# Altium project FlowCandle.PrjPcb
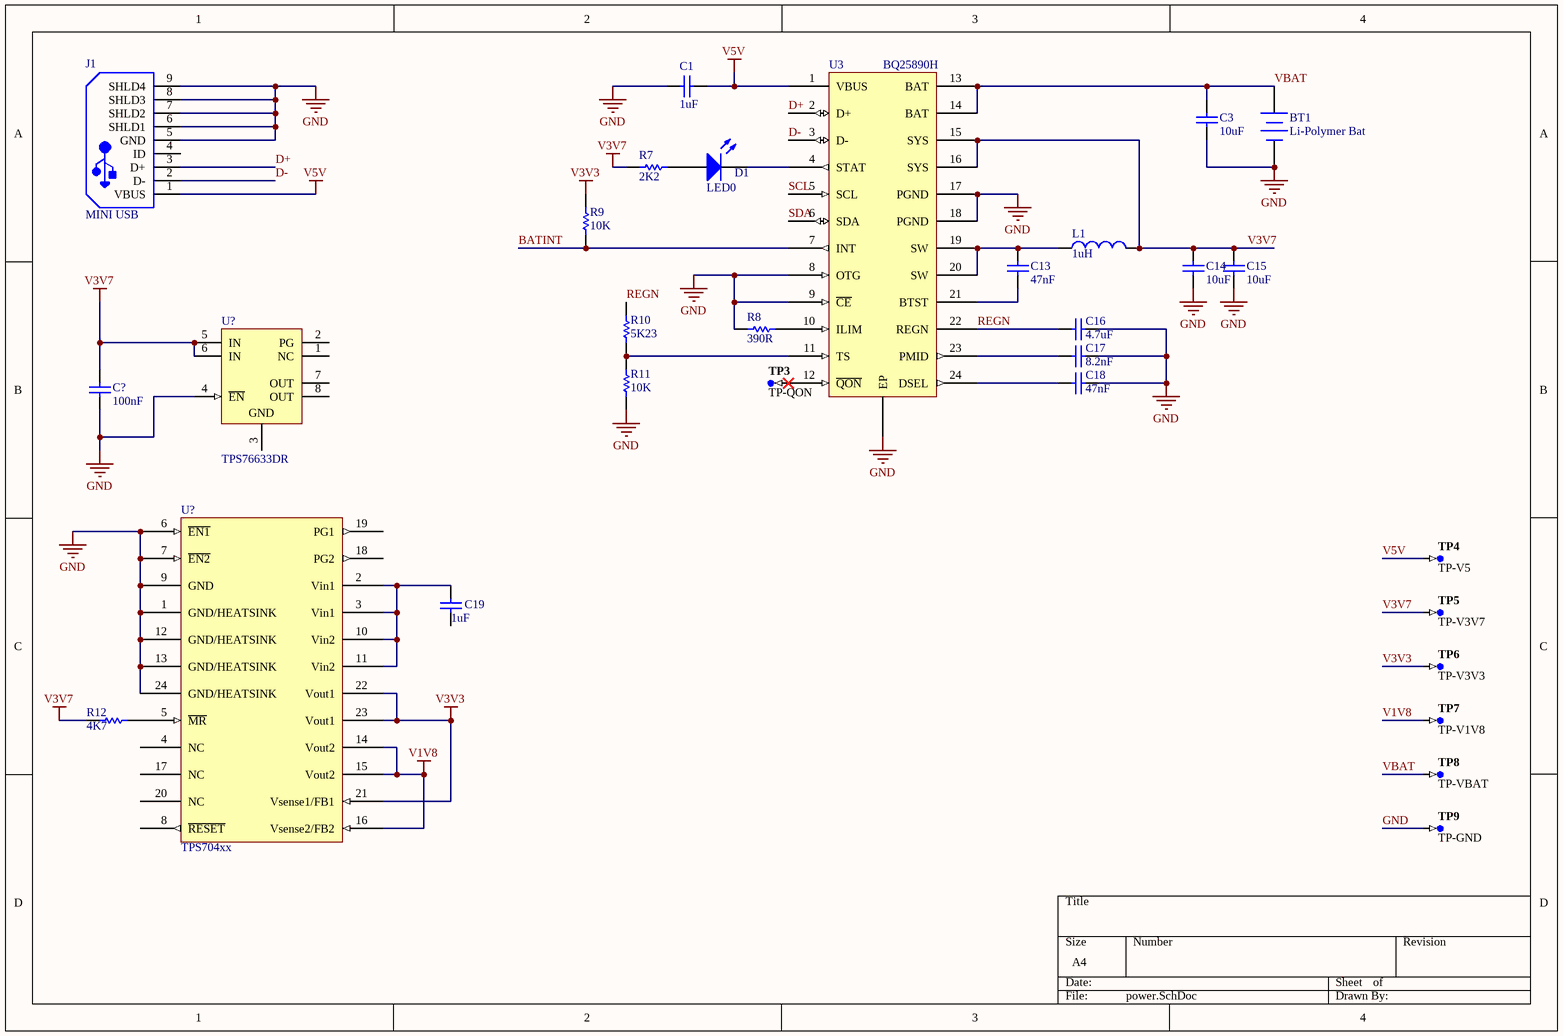
[diagram p0: power.SchDoc]
2 sheets, 54 parts. Net scope: global (net labels, ports and power ports of the same name join across sheets).
Board file: candlebtm.PcbDoc
Sheets:
  power.SchDoc
  board.SchDoc

## Sheet power.SchDoc
size A4; PageSetup: Record=PageOptions|CenterHorizontal=True|CenterVertical=True|PrintScale=0.97|XCorrection=1.00|YCorrection=1.00|PrintKind=1|BorderSize=5000000|LeftOffset=0|BottomOffset=0|Orientation=2|PaperLength=2970|PaperWidth=2100|Scale=100|PaperSource=1|PrintQuality=-3|MediaType=1|DitherType=10|PrintScaleMode=1|PaperKind=A4|PaperIndex=9

### Parts
(Parts that share a designator on the sheet are numbered #1, #2 ... from top to bottom, then left to right.)
BT1  Li-Polymer Bat  [BAT-2]
C1  1uF  [CAPC0603(1608)100_M]
C3  10uF  [CAPC0603(1608)100_M]
C13  47nF  [CAPC0603(1608)100_M]
C14  10uF  [CAPC0603(1608)100_M]
C15  10uF  [CAPC0603(1608)100_M]
C16  4.7uF  [CAPC0603(1608)100_M]
C17  8.2nF  [CAPC0603(1608)100_M]
C18  47nF  [CAPC0603(1608)100_M]
C19  1uF  [CAPC0603(1608)100_M]
C?  100nF  [CAPC0603(1608)100_M]
D1  LED0  [HDR1X2]
J1  MINI USB  [KYCN-KMBX-SMT-5S-S-30TR_V]
L1  value 1uH  [INDC3216]  (hidden comment: Inductor)
R7  2K2  [RESC0603(1608)_M]
R8  390R  [RESC0603(1608)_M]
R9  10K  [RESC0603(1608)_M]
R10  5K23  [RESC0603(1608)_M]
R11  10K  [RESC0603(1608)_M]
R12  4K7  [RESC0603(1608)_M]
TP3  TP-QON  [TP-SM-C-100]  (no BOM)
TP4  TP-V5  [TP-SM-C-100]  (no BOM)
TP5  TP-V3V7  [TP-SM-C-100]  (no BOM)
TP6  TP-V3V3  [TP-SM-C-100]  (no BOM)
TP7  TP-V1V8  [TP-SM-C-100]  (no BOM)
TP8  TP-VBAT  [TP-SM-C-100]  (no BOM)
TP9  TP-GND  [TP-SM-C-100]  (no BOM)
U3  BQ25890H  [RGE24-2700X2700TP]
U?#1  TPS76633DR  [D0008A_N]
U?#2  TPS704xx  [PWP0024A_M]

### Nets
GND: BT1.2(-) C1.1 C3.1 C14.1 C15.1 C16.2 C17.2 C18.2 C?.1 J1.5(GND) J1.6(SHLD1) J1.7(SHLD2) J1.8(SHLD3) J1.9(SHLD4) R8.1 R11.1 TP9.1 U3.8(OTG) U3.9(~{CE}) U3.17(PGND) U3.18(PGND) U3.25(EP) U?#1.4(~{EN}) U?#2.1(GND/HEATSINK) U?#2.6(~{EN1}) U?#2.7(~{EN2}) U?#2.9(GND) U?#2.12(GND/HEATSINK) U?#2.13(GND/HEATSINK) U?#2.24(GND/HEATSINK)
V1V8: TP7.1 U?#2.14(Vout2) U?#2.15(Vout2) U?#2.16(Vsense2/FB2)
V3V3: R9.2 TP6.1 U?#2.21(Vsense1/FB1) U?#2.22(Vout1) U?#2.23(Vout1)
V3V7: C14.2 C15.2 C?.2 L1.2 R7.1 R12.1 TP5.1 U3.15(SYS) U3.16(SYS) U?#1.5(IN) U?#1.6(IN)
V5V: C1.2 J1.1(VBUS) TP4.1 U3.1(VBUS)
BATINT: R9.1 U3.7(INT)
D+: J1.3(D+) U3.2(D+)
D-: J1.2(D-) U3.3(D-)
REGN: C16.1 R10.2 U3.22(REGN)
SCL: U3.5(SCL)
SDA: U3.6(SDA)
VBAT: BT1.1(+) C3.2 TP8.1 U3.13(BAT) U3.14(BAT)
NetC13_1: C13.1 U3.21(BTST)
NetC13_2: C13.2 L1.1 U3.19(SW) U3.20(SW)
NetC17_1: C17.1 U3.23(PMID)
NetC18_1: C18.1 U3.24(DSEL)
NetC19_2: C19.2 U?#2.2(Vin1) U?#2.3(Vin1) U?#2.10(Vin2) U?#2.11(Vin2)
NetD1_1: D1.1(A) R7.2
NetD1_2: D1.2(K) U3.4(STAT)
NetR8_2: R8.2 U3.10(ILIM)
NetR10_1: R10.1 R11.2 U3.11(TS)
NetR12_2: R12.2 U?#2.5(~{MR})
NetTP3_1: TP3.1 U3.12(~{QON})

Not connected (* = marked no-connect by the designer): C19 1; J1 4(ID); U?#1 1(NC) 2(PG) 3(GND) 7(OUT) 8(OUT); U?#2 4(NC) 8(~{RESET}) 17(NC) 18(PG2) 19(PG1) 20(NC)

### Library data of the parts
BT1 = Battery: Multicell Battery; Published: 24-Mar-1999; LatestRevisionDate: 17-Jul-2002; LatestRevisionNote: Re-released for DXP Platform.; PackageReference: BAT-2; Publisher: Altium Limited; PackageDescription: Battery; 2 Leads
C1 C19 = CMP-1034-02119-1: CAP 1uF 16V ±10% 0402 (1005 Metric) Thickness 0.6mm SMD; Case-EIA: 0402; Tolerance: Â±10%; Case-Metric: 1005; Technology: SMT; Rated Voltage: 16 V; Max Thickness: 0.6 mm; Value: 1uF
C3 C14 C15 = CMP-1036-04927-1: CAP 10uF 16V ±10% 0805 (2012 Metric) Thickness 1.45mm SMD; Case-EIA: 0805; Tolerance: Â±10%; Case-Metric: 2012; Rated Voltage: 16 V; Technology: SMT; Value: 10uF; Max Thickness: 1.45 mm
C13 C18 = CMP-1035-02503-1: CAP 47nF 16V ±10% 0603 (1608 Metric) Thickness 1mm SMD; Tolerance: Â±10%; Case-EIA: 0603; Case-Metric: 1608; Technology: SMT; Rated Voltage: 16 V; Max Thickness: 1 mm; Value: 47nF
C16 = CMP-1034-02133-1: CAP 4.7uF 4V ±10% 0402 (1005 Metric) Thickness 0.6mm SMD; Tolerance: Â±10%; Case-Metric: 1005; Case-EIA: 0402; Value: 4.7uF; Rated Voltage: 4 V; Technology: SMT; Max Thickness: 0.6 mm
C17 = CMP-1035-02285-1: CAP 8.2nF 16V ±10% 0603 (1608 Metric) Thickness 1mm SMD; Case-Metric: 1608; Case-EIA: 0603; Tolerance: Â±10%; Value: 8.2nF; Max Thickness: 1 mm; Rated Voltage: 16 V; Technology: SMT
C? = CMP-1034-02064-1: CAP 100nF 10V ±5% 0402 (1005 Metric) Thickness 0.6mm SMD; Tolerance: Â±5%; Case-EIA: 0402; Case-Metric: 1005; Max Thickness: 0.6 mm; Value: 100nF; Rated Voltage: 10 V; Technology: SMT
D1 = LED0: Typical INFRARED GaAs LED; Published: 8-Jun-2000; LatestRevisionDate: 08-Jul-2005; LatestRevisionNote: Mech Layer 1 removed.; PackageReference: LED-0; Publisher: Altium Limited; PackageDescription: LED; 2 Leads
J1 = CMP-1673-00002-6: Female Mini-USB, RA, -55 to 85 degC, 5-Pin SMD, RoHS, Tape and Reel; Manufacturer: Kycon; Current Rating: 1 A; Contact Material: Bronze; Packaging: Tape and Reel; ComponentLink1Description: Manufacturer URL; Mount: Surface Mount; ComponentLink2URL: https://datasheet.ciiva.com/4599/kmbx-smt-5s-s-30tr-180268-4599029.pdf; Colour: Black; Length: 9.9 mm; RoHSCompliant: true; Pins: 5; Mounting Technology: Surface Mount; Height: 3.9 mm; Connector Type: USB; PackageDescription: 5-Pin Surface Mount Device, Body 9.9 x 9.2 mm, Pitch 0.8 mm; ComponentLink1URL: http://www.kycon.com/; PackageReference: KMBX-SMT-5S-S-30TR; ComponentLink2Description: Datasheet; DatasheetVersion: Rev. A7, 11/2013; Contact Plating: Gold; Lead Pitch: 0.8 mm
L1 = Inductor: Code_IEC: 1005; Published: 8-Jun-2000; LatestRevisionDate: 29-May-2009; LatestRevisionNote: IPC-7351 Footprint Added.; PackageReference: 0402-A; Publisher: Altium Limited; PackageDescription: Chip Inductor; Code_JEITA: 0402
R7 = CMP-1012-00082-1: 2K2 0.1W 5% 0603 (1608 Metric)  SMD; Case-Metric: 1608; Value: 2200.00 Ohm; Case-EIA: 0603; Power: 0.1 W; Tolerance: 5 %; Technology: SMT
R8 = CMP-1012-00064-1: 390R 0.1W 5% 0603 (1608 Metric)  SMD; Case-EIA: 0603; Value: 390.00 Ohm; Case-Metric: 1608; Technology: SMT; Power: 0.1 W; Tolerance: 5 %
R9 R11 = CMP-1011-00098-1: Tolerance: 5 %; Value: 10000.00 Ohm; Case-EIA: 0402; Case-Metric: 1005; Power: 0.063 W; Technology: SMT
R10 = CMP-1012-00592-1: 5K23 0.1W 1% 0603 (1608 Metric)  SMD; Case-Metric: 1608; Value: 5230.00 Ohm; Case-EIA: 0603; Tolerance: 1 %; Technology: SMT; Power: 0.1 W
R12 = CMP-1011-00090-1: 4K7 0.063W 5% 0402 (1005 Metric)  SMD; Value: 4700.00 Ohm; Case-EIA: 0402; Case-Metric: 1005; Tolerance: 5 %; Power: 0.063 W; Technology: SMT
TP3-TP9 = CMP-0484-00002-2: Test Point, Surface Mount, Circular, Pad Diameter 1 mm; Manufacturer: No Vendor; PartNumber: TP-SM-C-100
U3 = BQ25890H: I2C Controlled 5A Single Cell with NVDC Power Path Management
U?#1 = CMP-0394-00013-2: Single Output LDO, 250 mA, Fixed 3.3 V Output, 2.7 to 10 V Input, with Low IQ, 8-pin SOIC (D), -40 to 125 degC, Green (RoHS & no Sb/Br); Manufacturer: Texas Instruments; Power Good: TRUE; Vdo(Typ)(mV): 230; Fixed Output Options(V): 3.3; Iout(Max)(A): 0.25; Iq(Typ)(mA): 0.03; Vin(Max)(V): 10; SubFamily: Single Channel LDO; Vin(Min)(V): 2.7; Code_JEDEC: MS-012; ComponentLink1Description: Manufacturer URL; ComponentLink2URL: http://www.ti.com/general/docs/lit/getliterature.tsp?genericPartNumber=TPS76633&fileType=pdf; Mounting Technology: Surface Mount; ComponentLink1URL: http://www.ti.com/; PackageVersion: 4040047-3/M; ComponentLink3Description: Package Specification; DatasheetVersion: SLVS237C; Vout Adj(Max)(V): 3.3; ComponentLink2Description: Datasheet; PackageReference: D0008A; ComponentLink3URL: http://www.ti.com/litv/pdf/msoi002j; Vout Adj(Min)(V): 3.3; PartNumber: TPS76633DR; Eco-Plan: Green (RoHS & no Sb/Br); PackageDescription: 8-Pin Plastic Small Outline, Body 4.9 x 3.9 mm, Pitch 1.27 mm
U?#2 = TPS704: DUAL-OUTPUT, LOW DROPOUT VOLTAGE REGULATORS WITH INTEGRATED SVS FOR SPLIT VOLTAGE SYSTEMS

## Sheet board.SchDoc
size A4
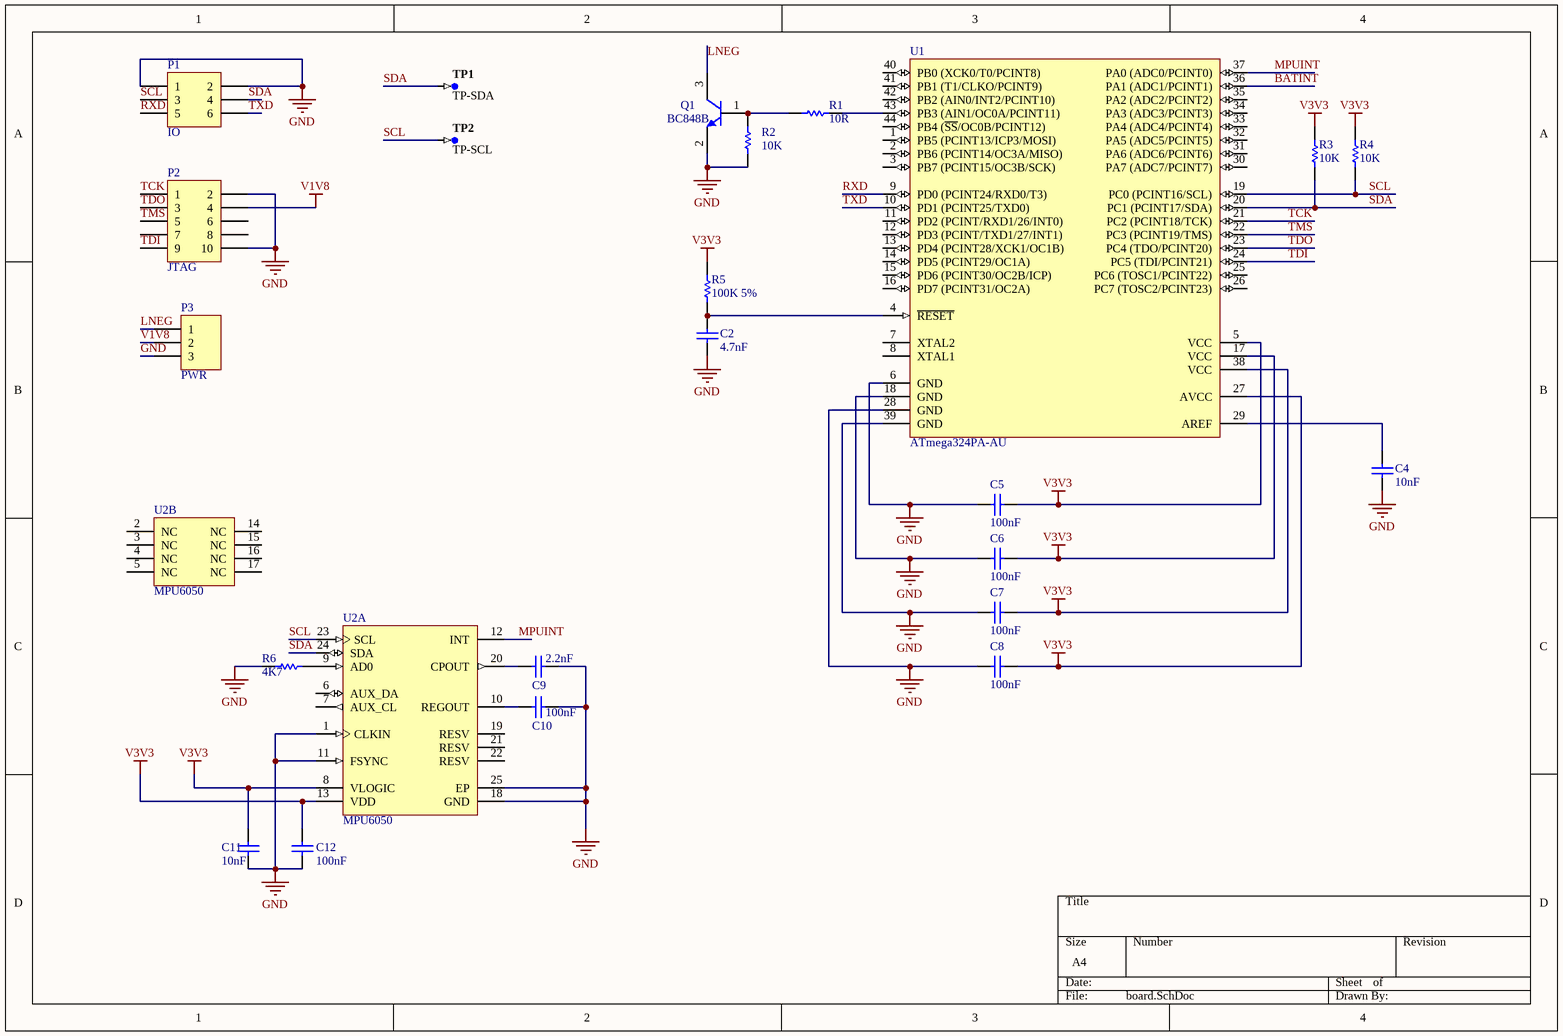
[diagram p1: board.SchDoc]

### Parts
C2  4.7nF  [CAPC0603(1608)100_M]
C4  10nF  [CAPC0603(1608)100_M]
C5  100nF  [CAPC0603(1608)100_M]
C6  100nF  [CAPC0603(1608)100_M]
C7  100nF  [CAPC0603(1608)100_M]
C8  100nF  [CAPC0603(1608)100_M]
C9  2.2nF  [CAPC0603(1608)100_M]
C10  100nF  [CAPC0603(1608)100_M]
C11  10nF  [CAPC0603(1608)100_M]
C12  100nF  [CAPC0603(1608)100_M]
P1  IO  [HDR2X3]
P2  JTAG  [HDR2X5]
P3  PWR  [HDR1X3]
Q1  BC848B  [INF-SOT23_N]
R1  10R  [RESC0603(1608)_M]
R2  10K  [RESC0603(1608)_M]
R3  10K  [RESC0603(1608)_M]
R4  10K  [RESC0603(1608)_M]
R5  100K 5%  [RESC0603(1608)_M]
R6  4K7  [RESC0603(1608)_M]
TP1  TP-SDA  [TP-SM-C-100]  (no BOM)
TP2  TP-SCL  [TP-SM-C-100]  (no BOM)
U1  ATmega324PA-AU  [44A_M]
U2  MPU6050  [INSE-QFN-24_V]  (parts A,B of 2)

### Nets
GND: C2.1 C4.1 C5.1 C6.1 C7.1 C8.1 C9.2 C10.2 C11.1 C12.1 P1.1 P1.2 P2.2 P2.10 P3.3 Q1.2(E) R2.1 R6.1 U1.6(GND) U1.18(GND) U1.28(GND) U1.39(GND) U2.1(CLKIN) U2.11(FSYNC) U2.18(GND) U2.25(EP)
V1V8: P2.4 P3.2
V3V3: C5.2 C6.2 C7.2 C8.2 C11.2 C12.2 R3.2 R4.2 R5.2 U1.5(VCC) U1.17(VCC) U1.27(AVCC) U1.38(VCC) U2.8(VLOGIC) U2.13(VDD)
BATINT: U1.36(PA1_(ADC1/PCINT1))
LNEG: P3.1 Q1.3(C)
MPUINT: U1.37(PA0_(ADC0/PCINT0)) U2.12(INT)
RXD: P1.5 U1.9(PD0_(PCINT24/RXD0/T3))
SCL: P1.3 R4.1 TP2.1 U1.19(PC0_(PCINT16/SCL)) U2.23(SCL)
SDA: P1.4 R3.1 TP1.1 U1.20(PC1_(PCINT17/SDA)) U2.24(SDA)
TCK: P2.1 U1.21(PC2_(PCINT18/TCK))
TDI: P2.9 U1.24(PC5_(TDI/PCINT21))
TDO: P2.3 U1.23(PC4_(TDO/PCINT20))
TMS: P2.5 U1.22(PC3_(PCINT19/TMS))
TXD: P1.6 U1.10(PD1_(PCINT25/TXD0))
NetC2_2: C2.2 R5.1 U1.4(~{RESET})
NetC4_2: C4.2 U1.29(AREF)
NetC9_1: C9.1 U2.20(CPOUT)
NetC10_1: C10.1 U2.10(REGOUT)
NetQ1_1: Q1.1(B) R1.1 R2.2
NetR1_2: R1.2 U1.43(PB3_(AIN1/OC0A/PCINT11))
NetR6_2: R6.2 U2.9(AD0)

Not connected (* = marked no-connect by the designer): P2 6 7 8; U1 1(PB5_(PCINT13/ICP3/MOSI)) 2(PB6_(PCINT14/OC3A/MISO)) 3(PB7_(PCINT15/OC3B/SCK)) 7(XTAL2) 8(XTAL1) 11(PD2_(PCINT/RXD1/26/INT0)) 12(PD3_(PCINT/TXD1/27/INT1)) 13(PD4_(PCINT28/XCK1/OC1B)) 14(PD5_(PCINT29/OC1A)) 15(PD6_(PCINT30/OC2B/ICP)) 16(PD7_(PCINT31/OC2A)) 25(PC6_(TOSC1/PCINT22)) 26(PC7_(TOSC2/PCINT23)) 30(PA7_(ADC7/PCINT7)) 31(PA6_(ADC6/PCINT6)) 32(PA5_(ADC5/PCINT5)) 33(PA4_(ADC4/PCINT4)) 34(PA3_(ADC3/PCINT3)) 35(PA2_(ADC2/PCINT2)) 40(PB0_(XCK0/T0/PCINT8)) 41(PB1_(T1/CLKO/PCINT9)) 42(PB2_(AIN0/INT2/PCINT10)) 44(PB4_(~{SS}/OC0B/PCINT12)); U2 2(NC) 3(NC) 4(NC) 5(NC) 6(AUX_DA) 7(AUX_CL) 14(NC) 15(NC) 16(NC) 17(NC) 19(RESV) 21(RESV) 22(RESV)

### Notes on the sheet
- Title
- Size:
- Date:
- A4
- Number:
- Time:
- Revision:
- Sheet
- of
- File:

### Library data of the parts
C2 = CMP-1034-01811-1: CAP 4.7nF 16V ±20% 0402 (1005 Metric) Thickness 0.6mm SMD; Case-EIA: 0402; Tolerance: Â±20%; Case-Metric: 1005; Technology: SMT; Value: 4.7nF; Max Thickness: 0.6 mm; Rated Voltage: 16 V
C4 = CMP-1034-01883-1: CAP 10nF 35V ±10% 0402 (1005 Metric) Thickness 0.6mm SMD; Tolerance: Â±10%; Case-Metric: 1005; Case-EIA: 0402; Rated Voltage: 35 V; Technology: SMT; Value: 10nF; Max Thickness: 0.6 mm
C5-C8 = CMP-1034-02068-1: CAP 100nF 16V ±5% 0402 (1005 Metric) Thickness 0.6mm SMD; Tolerance: Â±5%; Case-EIA: 0402; Case-Metric: 1005; Technology: SMT; Value: 100nF; Max Thickness: 0.6 mm; Rated Voltage: 16 V
C9 = CMP-1034-01722-1: CAP 2.2nF 6.3V ±5% 0402 (1005 Metric) Thickness 0.6mm SMD; Tolerance: Â±5%; Case-EIA: 0402; Case-Metric: 1005; Max Thickness: 0.6 mm; Technology: SMT; Rated Voltage: 6.3 V; Value: 2.2nF
C10 C12 = CMP-1034-02064-1: as C? on sheet power; Max Thickness: 0.6 mm; Value: 100nF; Rated Voltage: 10 V; Technology: SMT
C11 = CMP-1034-01880-1: CAP 10nF 25V ±10% 0402 (1005 Metric) Thickness 0.6mm SMD; Tolerance: Â±10%; Case-Metric: 1005; Case-EIA: 0402; Technology: SMT; Value: 10nF; Max Thickness: 0.6 mm; Rated Voltage: 25 V
P1 = Header 3X2: Header, 3-Pin, Dual row; LatestRevisionDate: 17-Jul-2002; LatestRevisionNote: Re-released for DXP Platform.; Publisher: Altium Limited
P2 = Header 5X2: Header, 5-Pin, Dual row; LatestRevisionDate: 17-Jul-2002; LatestRevisionNote: Re-released for DXP Platform.; Publisher: Altium Limited
P3 = Header 3: Header, 3-Pin; LatestRevisionDate: 17-Jul-2002; LatestRevisionNote: Re-released for DXP Platform.; Publisher: Altium Limited
Q1 = CMP-1177-00031-1: NPN Silicon AF Transistor, 30 V VCEO, 100 mA IC, SOT23, Reel, Green; Manufacturer: Infineon; VCEO (max): 30Â V; ICM (max): 200Â mA; VEBO (max): 6Â V; Green: TRUE; IC (max): 100Â mA; ICBO (max): 15Â nA; fT (typ): 250Â MHz; Ptot (max): 330Â mW; ComponentLink1Description: Manufacturer URL; ComponentLink3URL: http://www.infineon.com/dgdl/SOT23-Package_Overview.pdf?folderId=db3a30431936bc4b0119532290053c66&fileId=db3a30431936bc4b0119533468123c85; ComponentLink1URL: http://www.infineon.com/; ComponentLink2URL: http://www.infineon.com/dgdl/bc847series_bc848series_bc849series_bc850series.pdf?folderId=db3a304314dca389011541d30fa21656&fileId=db3a304314dca389011541d4630a1657; Packing: Reel; Polarity: NPN; IBM (max): 200Â mA; PartNumber: BC848B; VCBO (max): 30Â V; Mounting Technology: Surface Mount; PackageVersion: Apr-08; PackageDescription: 3-Pin Small Outline Transistor Package, 1.3 x 2.9 mm Body, 0.95 mm Pitch; ComponentLink3Description: Package Specification; PackageReference: SOT23; ComponentLink2Description: Datasheet
R1 = CMP-1011-00026-1: 10R 0.063W 5% 0402 (1005 Metric)  SMD; Case-EIA: 0402; Case-Metric: 1005; Value: 10.00 Ohm; Power: 0.063 W; Tolerance: 5 %; Technology: SMT
R2 = CMP-1011-00098-1: 10K 0.063W 5% 0402 (1005 Metric)  SMD; Case-Metric: 1005; Value: 10000.00 Ohm; Case-EIA: 0402; Technology: SMT; Tolerance: 5 %; Power: 0.063 W
R3 R4 = CMP-1011-00098-1: as R9 on sheet power; Technology: SMT
R5 = CMP-1011-00122-1: 100K 0.063W 5% 0402 (1005 Metric)  SMD; Value: 100000.00 Ohm; Case-EIA: 0402; Case-Metric: 1005; Power: 0.063 W; Technology: SMT; Tolerance: 5 %
R6 = CMP-1011-00090-1: as R12 on sheet power; Tolerance: 5 %; Power: 0.063 W; Technology: SMT
TP1 TP2 = CMP-0484-00002-2: as TP3 on sheet power; PartNumber: TP-SM-C-100
U1 = CMP-0095-00308-2: 8-bit AVR Microcontroller, 32KB Flash, 1KB EEPROM, 2KB SRAM, 44-pin TQFP, Industrial Grade (-40°C to 85°C); ComponentLink2Description: ATmega164A/164PA/324A/324PA/644A/644PA/1284/1284P Datasheet; Code_JEDEC: MS-026-ACB; ComponentLink3Description: ATmega164A/164PA/324A/324PA/644A/644PA/1284/1284P Summary; ComponentLink3URL: http://www.atmel.com/dyn/resources/prod_documents/8272S.pdf; ComponentLink1Description: Manufacturer URL; PackageReference: 44A; PackageDescription: 44-Pin Plastic Thin Profile Quad Flat Pack, 10 x 10 x 1.0 mm Body, 0.8 mm Pitch (TQFP); ComponentLink1URL: http://www.atmel.com/; RevisionNote: DatasheetVersion & PackageVersion updated. Sch pin names updated. URLs added.; PackageVersion: revC, Oct-2010; DatasheetVersion: revC, Jun-2011; ComponentLink2URL: http://www.atmel.com/dyn/resources/prod_documents/doc8272.pdf
U2 = CMP-1753-00002-1: 3-Axis Gyroscope, 3-Axis Accelerometer / , 2.375 to 3.46 V, -40 to 105 degC, 24-Pin QFN, RoHS, Tape and Reel; Resistance: 5.6 kohm; Tolerance: 1%; Voltage Rating: 75 V; Power Rating: 100 mW; ComponentLink1Description: Manufacturer URL; Mount: Surface Mount; Max Operating Temperature: 155degC; Package Quantity: 5000; ComponentLink2Description: Datasheet; Pins: 2; Packaging: Tape and Reel; Case Code (Imperial): 0603; PackageReference: QFN-24; ComponentLink2URL: https://datasheet.ciiva.com/1513/1788002-1513632.pdf; Radiation Hardening: No; ComponentLink1URL: http://www.invensense.com/; PackageDescription: 24-Pin Quad Flat No-lead Package, Body 4 x 4 mm, Pitch 0.5 mm; Height: 0.45 mm; Case/Package: 0603; Case Code (Metric): 1608; REACH SVHC: Yes; Min Operating Temperature: -55degC; DatasheetVersion: Rev. 3.4, 08/2013; Width: 0.8 mm; RoHSCompliant: True; Length: 1.6 mm; PartId: 1

## Nets that join several sheets
GND: power (30 pins), board (26 pins)
V1V8: power (TP7.1 U?#2.14 U?#2.15 U?#2.16), board (P2.4 P3.2)
V3V3: power (5 pins), board (15 pins)
BATINT: power (R9.1 U3.7), board (U1.36)
SCL: power (U3.5), board (5 pins)
SDA: power (U3.6), board (5 pins)